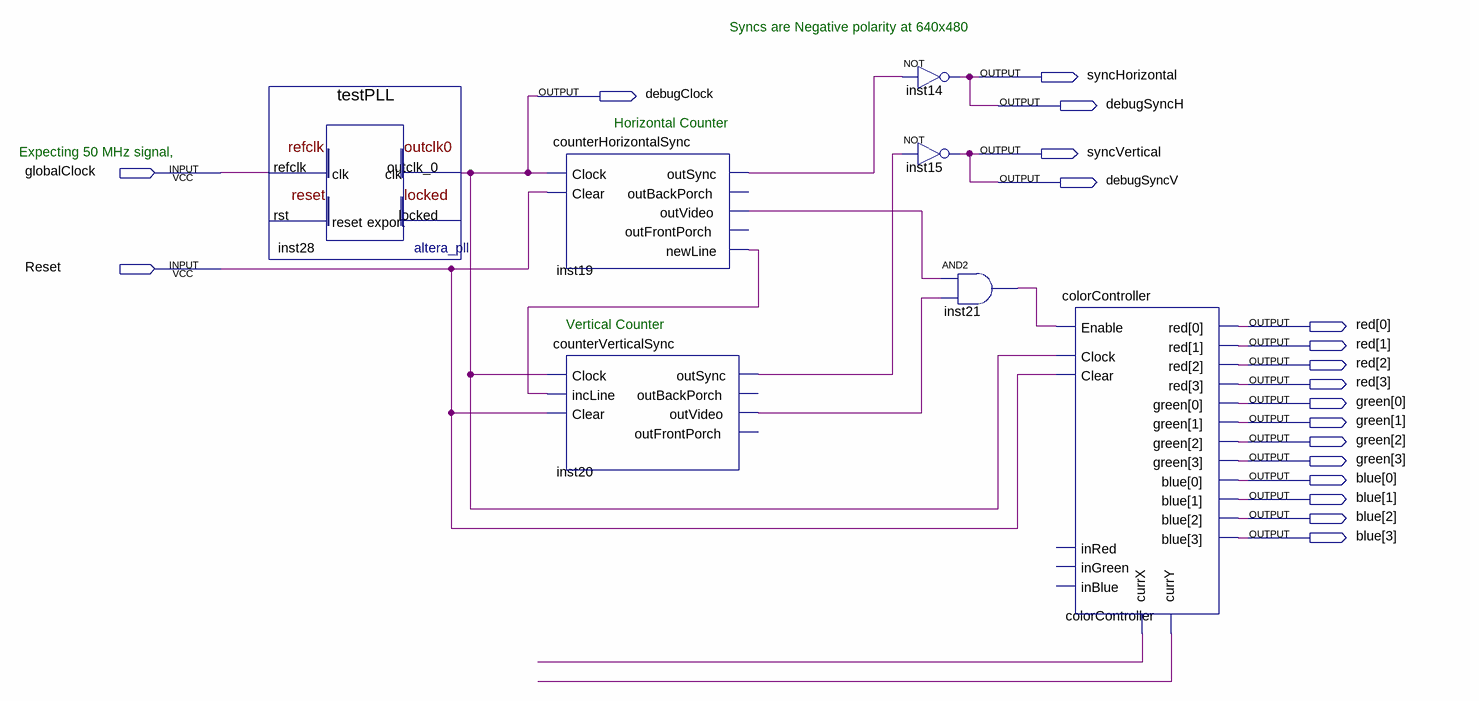
[diagram p0: schematic sheet]
// Quartus schematic vgaControllerBak.bdf as structural Verilog: 7 symbols, 19 pins
module vgaControllerBak (
  input  globalClock,
  input  Reset,
  output syncHorizontal,
  output debugClock,
  output debugSyncH,
  output syncVertical,
  output debugSyncV,
  output [3:0] red,
  output [3:0] green,
  output [3:0] blue
);

  wire colorController_currx, colorController_curry, inst19_newline, inst19_outsync, inst19_outvideo,
       inst20_outsync, inst20_outvideo, inst21_out;

  testPLL inst28 (.refclk(globalClock), .outclk_0(debugClock));  // open: rst, locked
  counterHorizontalSync inst19 (
    .Clock(debugClock), .Clear(Reset), .outSync(inst19_outsync), .outVideo(inst19_outvideo),
    .newLine(inst19_newline));  // open: outBackPorch, outFrontPorch
  counterVerticalSync inst20 (
    .Clock(debugClock), .incLine(inst19_newline), .Clear(Reset), .outSync(inst20_outsync),
    .outVideo(inst20_outvideo));  // open: outBackPorch, outFrontPorch
  not inst14 (debugSyncH, inst19_outsync);
  not inst15 (debugSyncV, inst20_outsync);
  and inst21 (inst21_out, inst19_outvideo, inst20_outvideo);
  colorController colorController (
    .Enable(inst21_out), .Clock(debugClock), .Clear(Reset), .red(red), .green(green), .blue(blue),
    .currX(colorController_currx), .currY(colorController_curry));  // open: inRed, inGreen, inBlue

  assign syncHorizontal = debugSyncH;
  assign syncVertical = debugSyncV;

  // Notes on the sheet:
  //   Syncs are Negative polarity at 640x480
  //   Horizontal Counter
  //   Expecting 50 MHz signal,
  //   Vertical Counter
endmodule
